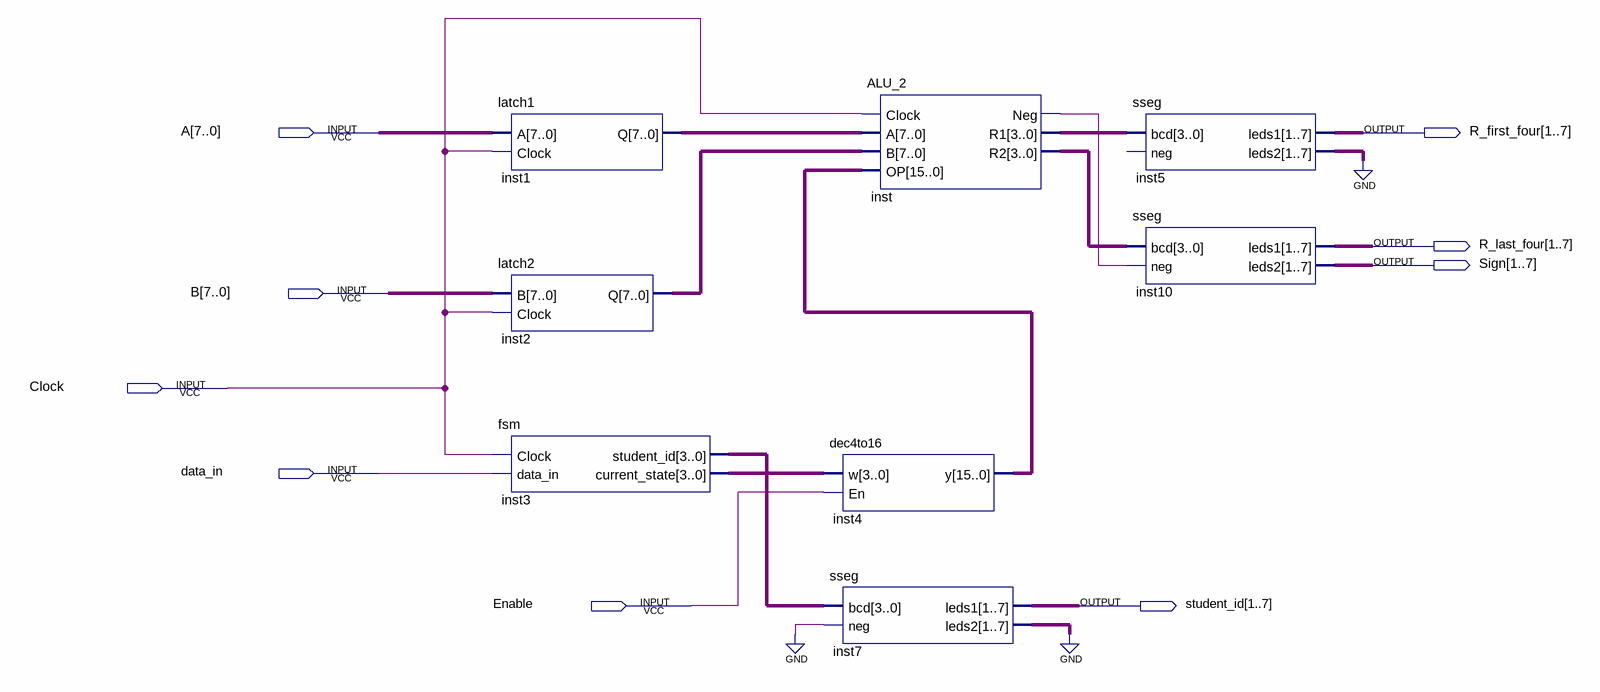
[diagram p0: schematic sheet]
// Quartus schematic ALU2_BlockDiagram.bdf as structural Verilog: 8 symbols, 9 pins
module ALU2_BlockDiagram (
  input  [7:0] A,
  input  [7:0] B,
  input  Clock,
  input  data_in,
  input  Enable,
  output [1:7] R_first_four,
  output [1:7] R_last_four,
  output [1:7] Sign,
  output [1:7] student_id
);

  wire inst_neg;
  wire [3:0] inst3_current_state, inst3_student_id, inst_r1, inst_r2;
  wire [6:0] inst5_leds2, inst7_leds2;
  wire [7:0] inst1_q, inst2_q;
  wire [15:0] inst4_y;

  latch1 inst1 (.A(A), .Clock(Clock), .Q(inst1_q));
  latch2 inst2 (.B(B), .Clock(Clock), .Q(inst2_q));
  fsm inst3 (.Clock(Clock), .data_in(data_in), .student_id(inst3_student_id), .current_state(inst3_current_state));
  dec4to16 inst4 (.w(inst3_current_state), .En(Enable), .y(inst4_y));
  sseg inst7 (.bcd(inst3_student_id), .neg(1'b0), .leds1(student_id), .leds2(inst7_leds2));
  ALU_2 inst (.Clock(Clock), .A(inst1_q), .B(inst2_q), .OP(inst4_y), .Neg(inst_neg), .R1(inst_r1), .R2(inst_r2));
  sseg inst5 (.bcd(inst_r1), .leds1(R_first_four), .leds2(inst5_leds2));  // open: neg
  sseg inst10 (.bcd(inst_r2), .neg(inst_neg), .leds1(R_last_four), .leds2(Sign));
  // also tied to GND on the sheet: {inst7_leds2[0], inst7_leds2[1], inst7_leds2[2], inst7_leds2[3], inst7_leds2[4], inst7_leds2[5], inst7_leds2[6], inst5_leds2[0], inst5_leds2[1], inst5_leds2[2], inst5_leds2[3], inst5_leds2[4], inst5_leds2[5], inst5_leds2[6]}
endmodule
